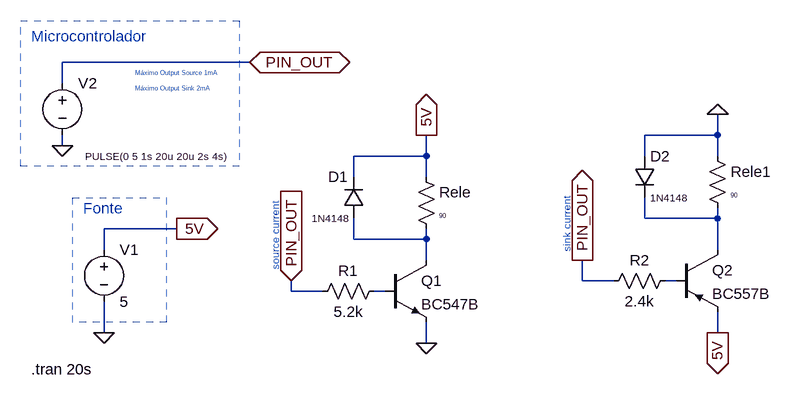
[diagram p0: schematic Driver Corrente Source Sink.asc]
Driver Corrente Source Sink.asc, the LTspice schematic file:
Version 4
SHEET 1 932 680
WIRE -112 -48 -400 -48
WIRE -400 -16 -400 -48
WIRE 608 64 608 32
WIRE 608 64 496 64
WIRE -400 80 -400 64
WIRE 160 96 160 64
WIRE 160 96 48 96
WIRE 496 96 496 64
WIRE 608 96 608 64
WIRE 48 128 48 96
WIRE 160 128 160 96
WIRE 496 192 496 160
WIRE 608 192 608 176
WIRE 608 192 496 192
WIRE -224 208 -336 208
WIRE 48 224 48 192
WIRE 160 224 160 208
WIRE 160 224 48 224
WIRE -336 240 -336 208
WIRE 608 240 608 192
WIRE 160 256 160 224
WIRE 400 288 400 256
WIRE 448 288 400 288
WIRE 544 288 528 288
WIRE -48 304 -48 288
WIRE 0 304 -48 304
WIRE 96 304 80 304
WIRE -336 368 -336 320
WIRE 608 368 608 336
WIRE 160 384 160 352
FLAG 160 384 0
FLAG -336 368 0
FLAG -400 80 0
FLAG -224 208 5V
IOPIN -224 208 Out
FLAG 160 64 5V
IOPIN 160 64 Out
FLAG 608 368 5V
IOPIN 608 368 Out
FLAG 608 32 0
FLAG -112 -48 PIN_OUT
IOPIN -112 -48 BiDir
FLAG -48 288 PIN_OUT
IOPIN -48 288 In
FLAG 400 256 PIN_OUT
IOPIN 400 256 Out
SYMBOL voltage -336 224 R0
WINDOW 123 0 0 Left 0
WINDOW 39 0 0 Left 0
SYMATTR InstName V1
SYMATTR Value 5
SYMBOL res 144 112 R0
WINDOW 3 36 76 Left 0
SYMATTR Value 90
SYMATTR InstName Rele
SYMBOL diode 64 192 R180
WINDOW 0 24 64 Left 2
WINDOW 3 24 0 Left 1
SYMATTR InstName D1
SYMATTR Value 1N4148
SYMBOL npn 96 256 R0
SYMATTR InstName Q1
SYMATTR Value BC547B
SYMBOL voltage -400 -32 R0
WINDOW 3 35 128 Left 1
WINDOW 123 0 0 Left 0
WINDOW 39 0 0 Left 0
SYMATTR Value PULSE(0 5 1s 20u 20u 2s 4s)
SYMATTR InstName V2
SYMBOL res 96 288 R90
WINDOW 0 0 56 VBottom 2
WINDOW 3 32 56 VTop 2
SYMATTR InstName R1
SYMATTR Value 5.2k
SYMBOL pnp 544 240 R0
SYMATTR InstName Q2
SYMATTR Value BC557B
SYMBOL res 592 80 R0
WINDOW 3 36 76 Left 0
SYMATTR Value 90
SYMATTR InstName Rele1
SYMBOL diode 480 96 R0
WINDOW 3 24 64 Left 1
SYMATTR Value 1N4148
SYMATTR InstName D2
SYMBOL res 544 272 R90
WINDOW 0 0 56 VBottom 2
WINDOW 3 32 56 VTop 2
SYMATTR InstName R2
SYMATTR Value 2.4k
TEXT -448 424 Left 2 !.tran 20s
TEXT -448 -88 Left 2 ;Microcontrolador
TEXT -288 -32 Left 0 ;Máximo Output Source 1mA
TEXT -368 176 Left 2 ;Fonte
TEXT -72 168 VRight 1 ;source current
TEXT 376 160 VRight 1 ;sink current
TEXT -288 -8 Left 0 ;Máximo Output Sink 2mA
RECTANGLE Normal -128 112 -464 -112 2
RECTANGLE Normal -240 352 -384 160 2

The netlist it stands for:
* Driver Corrente Source Sink.asc
V1 5V 0 5
Rele 5V N002 90
D1 N002 5V 1N4148
Q1 N002 N004 0 0 BC547B
V2 PIN_OUT 0 PULSE(0 5 1s 20u 20u 2s 4s)
R1 N004 PIN_OUT 5.2k
Q2 N001 N003 5V 0 BC557B
Rele1 0 N001 90
D2 0 N001 1N4148
R2 N003 PIN_OUT 2.4k
.model D D
.lib standard.dio
.model NPN NPN
.model PNP PNP
.lib standard.bjt
.tran 20s
* Microcontrolador
* Máximo Output Source 1mA
* Fonte
* source current
* sink current
* Máximo Output Sink 2mA
.backanno
.end